# Altium project PCB_Project.PrjPcb (part 2 of 2)

## Sheet Deneigus_PI_Arduino.SchDoc
size Tabloid; Date: Date; Author: Author 1; Revision: 1; Size: 11x17; Sheet_Name: PI_Arduino
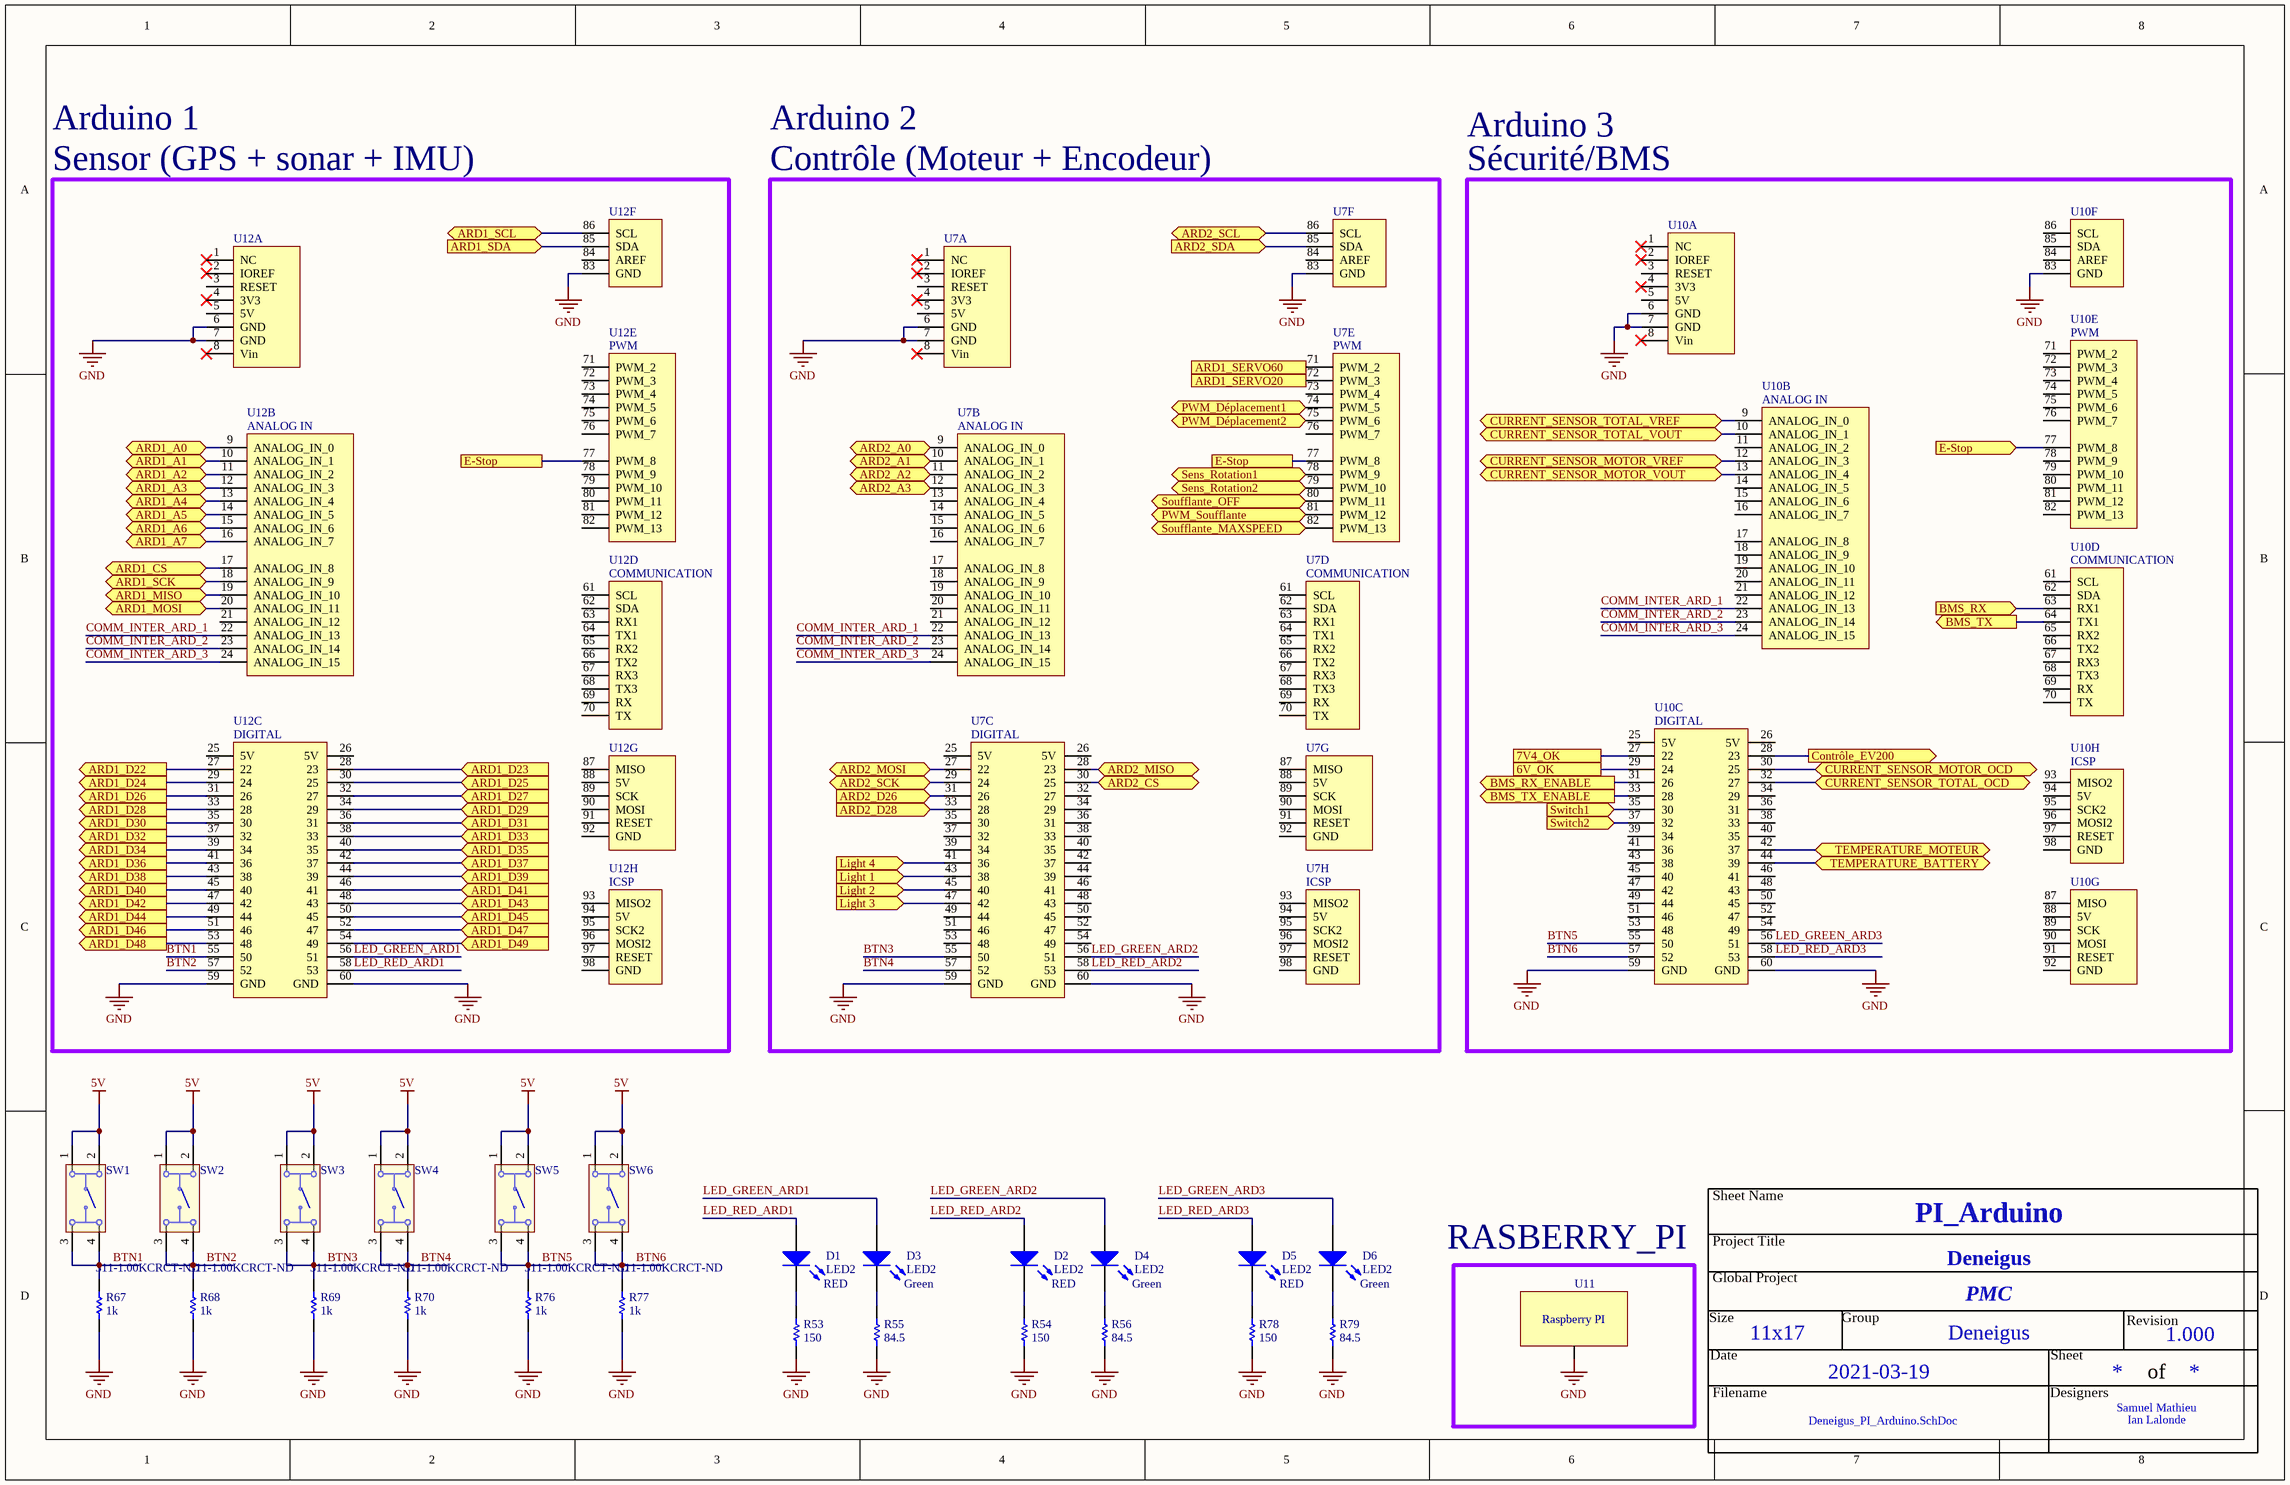
[diagram p6: Deneigus_PI_Arduino.SchDoc]

### Parts
D1  LED2  Color: RED  [DEL]
D2  LED2  Color: RED  [DEL]
D3  LED2  Color: Green  [DEL]
D4  LED2  Color: Green  [DEL]
D5  LED2  Color: RED  [DEL]
D6  LED2  Color: Green  [DEL]
R53  value 150  [RES_0805]  (hidden comment: Res1)
R54  value 150  [RES_0805]  (hidden comment: Res1)
R55  value 84.5  [RES_0805]  (hidden comment: Res1)
R56  value 84.5  [RES_0805]  (hidden comment: Res1)
R67  value 1k  Supplier Part Number 1: 311-1.00KCRCT-ND  [RES_0805]  (hidden comment: Res1)
R68  value 1k  Supplier Part Number 1: 311-1.00KCRCT-ND  [RES_0805]  (hidden comment: Res1)
R69  value 1k  Supplier Part Number 1: 311-1.00KCRCT-ND  [RES_0805]  (hidden comment: Res1)
R70  value 1k  Supplier Part Number 1: 311-1.00KCRCT-ND  [RES_0805]  (hidden comment: Res1)
R76  value 1k  Supplier Part Number 1: 311-1.00KCRCT-ND  [RES_0805]  (hidden comment: Res1)
R77  value 1k  Supplier Part Number 1: 311-1.00KCRCT-ND  [RES_0805]  (hidden comment: Res1)
R78  value 150  [RES_0805]  (hidden comment: Res1)
R79  value 84.5  [RES_0805]  (hidden comment: Res1)
SW1  430181038816  [430181038816]  (value not drawn)
SW2  430181038816  [430181038816]  (value not drawn)
SW3  430181038816  [430181038816]  (value not drawn)
SW4  430181038816  [430181038816]  (value not drawn)
SW5  430181038816  [430181038816]  (value not drawn)
SW6  430181038816  [430181038816]  (value not drawn)
U7  Arduino_Mega  [Arduino_Mega]  (value not drawn)  (parts A,B,C,D,E,F,G,H of 8)
U10  Arduino_Mega  [Arduino_Mega]  (value not drawn)  (parts A,B,C,D,E,F,G,H of 8)
U11  Raspberry PI 4  [Raspberry Pi 4]  (value not drawn)
U12  Arduino_Mega  [Arduino_Mega]  (value not drawn)  (parts A,B,C,D,E,F,G,H of 8)

### Blocks framed on the sheet
Sensor (GPS + sonar + IMU): U12
Contrôle (Moteur + Encodeur): U7
Sécurité/BMS: U10

### Ports
6V_OK, 7V4_OK, ARD1_A0 (bidir), ARD1_A1 (bidir), ARD1_A2 (bidir), ARD1_A3 (bidir), ARD1_A4 (bidir), ARD1_A5 (bidir), ARD1_A6 (bidir), ARD1_A7 (bidir), ARD1_CS (bidir), ARD1_D22 (out), ARD1_D23 (in), ARD1_D24 (out), ARD1_D25 (in), ARD1_D26 (out), ARD1_D27 (in), ARD1_D28 (out), ARD1_D29 (in), ARD1_D30 (out), ARD1_D31 (in), ARD1_D32 (out), ARD1_D33 (in), ARD1_D34 (out), ARD1_D35 (in), ARD1_D36 (out), ARD1_D37 (in), ARD1_D38 (out), ARD1_D39 (in), ARD1_D40 (out), ARD1_D41 (in), ARD1_D42 (out), ARD1_D43 (in), ARD1_D44 (out), ARD1_D45 (in), ARD1_D46 (out), ARD1_D47 (in), ARD1_D48 (out), ARD1_D49 (in), ARD1_MISO (bidir), ARD1_MOSI (bidir), ARD1_SCK (bidir), ARD1_SCL (bidir), ARD1_SDA (in), ARD1_SERVO20 (out), ARD1_SERVO60 (out), ARD2_A0 (bidir), ARD2_A1 (bidir), ARD2_A2 (bidir), ARD2_A3 (bidir), ARD2_CS (bidir), ARD2_D26 (in), ARD2_D28 (in), ARD2_MISO (bidir), ARD2_MOSI (bidir), ARD2_SCK (bidir), ARD2_SCL (bidir), ARD2_SDA (in), BMS_RX (in), BMS_RX_ENABLE (out), BMS_TX (out), BMS_TX_ENABLE (out), Contrôle_EV200 (out), CURRENT_SENSOR_MOTOR_OCD (bidir), CURRENT_SENSOR_MOTOR_VOUT (bidir), CURRENT_SENSOR_MOTOR_VREF (bidir), CURRENT_SENSOR_TOTAL_OCD (bidir), CURRENT_SENSOR_TOTAL_VOUT (bidir), CURRENT_SENSOR_TOTAL_VREF (bidir), E-Stop, E-Stop (in), Light 1 (in), Light 2 (in), Light 3 (in), Light 4 (in), PWM_Déplacement1 (bidir), PWM_Déplacement2 (bidir), PWM_Soufflante (bidir), Sens_Rotation1 (bidir), Sens_Rotation2 (bidir), Soufflante_MAXSPEED (bidir), Soufflante_OFF (bidir), Switch1 (in), Switch2 (in), TEMPERATURE_BATTERY (bidir), TEMPERATURE_MOTEUR (bidir)

### Nets
5V: SW1.1 SW1.2 SW2.1 SW2.2 SW3.1 SW3.2 SW4.1 SW4.2 SW5.1 SW5.2 SW6.1 SW6.2
GND: R53.2 R54.2 R55.2 R56.2 R67.2 R68.2 R69.2 R70.2 R76.2 R77.2 R78.2 R79.2 U7.6(GND) U7.7(GND) U7.59(GND) U7.60(GND) U7.83(GND) U10.6(GND) U10.7(GND) U10.59(GND) U10.60(GND) U10.83(GND) U11.0 U12.6(GND) U12.7(GND) U12.59(GND) U12.60(GND) U12.83(GND)
6V_OK: U10.29(24) ; port 6V_OK
7V4_OK: U10.27(22) ; port 7V4_OK
ARD1_A0: U12.9(ANALOG_IN_0) ; port ARD1_A0
ARD1_A1: U12.10(ANALOG_IN_1) ; port ARD1_A1
ARD1_A2: U12.11(ANALOG_IN_2) ; port ARD1_A2
ARD1_A3: U12.12(ANALOG_IN_3) ; port ARD1_A3
ARD1_A4: U12.13(ANALOG_IN_4) ; port ARD1_A4
ARD1_A5: U12.14(ANALOG_IN_5) ; port ARD1_A5
ARD1_A6: U12.15(ANALOG_IN_6) ; port ARD1_A6
ARD1_A7: U12.16(ANALOG_IN_7) ; port ARD1_A7
ARD1_CS: U12.17(ANALOG_IN_8) ; port ARD1_CS
ARD1_D22: U12.27(22) ; port ARD1_D22
ARD1_D23: U12.28(23) ; port ARD1_D23
ARD1_D24: U12.29(24) ; port ARD1_D24
ARD1_D25: U12.30(25) ; port ARD1_D25
ARD1_D26: U12.31(26) ; port ARD1_D26
ARD1_D27: U12.32(27) ; port ARD1_D27
ARD1_D28: U12.33(28) ; port ARD1_D28
ARD1_D29: U12.34(29) ; port ARD1_D29
ARD1_D30: U12.35(30) ; port ARD1_D30
ARD1_D31: U12.36(31) ; port ARD1_D31
ARD1_D32: U12.37(32) ; port ARD1_D32
ARD1_D33: U12.38(33) ; port ARD1_D33
ARD1_D34: U12.39(34) ; port ARD1_D34
ARD1_D35: U12.40(35) ; port ARD1_D35
ARD1_D36: U12.41(36) ; port ARD1_D36
ARD1_D37: U12.42(37) ; port ARD1_D37
ARD1_D38: U12.43(38) ; port ARD1_D38
ARD1_D39: U12.44(39) ; port ARD1_D39
ARD1_D40: U12.45(40) ; port ARD1_D40
ARD1_D41: U12.46(41) ; port ARD1_D41
ARD1_D42: U12.47(42) ; port ARD1_D42
ARD1_D43: U12.48(43) ; port ARD1_D43
ARD1_D44: U12.49(44) ; port ARD1_D44
ARD1_D45: U12.50(45) ; port ARD1_D45
ARD1_D46: U12.51(46) ; port ARD1_D46
ARD1_D47: U12.52(47) ; port ARD1_D47
ARD1_D48: U12.53(48) ; port ARD1_D48
ARD1_D49: U12.54(49) ; port ARD1_D49
ARD1_MISO: U12.19(ANALOG_IN_10) ; port ARD1_MISO
ARD1_MOSI: U12.20(ANALOG_IN_11) ; port ARD1_MOSI
ARD1_SCK: U12.18(ANALOG_IN_9) ; port ARD1_SCK
ARD1_SCL: U12.86(SCL) ; port ARD1_SCL
ARD1_SDA: U12.85(SDA) ; port ARD1_SDA
ARD1_SERVO20: U7.72(PWM_3) ; port ARD1_SERVO20
ARD1_SERVO60: U7.71(PWM_2) ; port ARD1_SERVO60
ARD2_A0: U7.9(ANALOG_IN_0) ; port ARD2_A0
ARD2_A1: U7.10(ANALOG_IN_1) ; port ARD2_A1
ARD2_A2: U7.11(ANALOG_IN_2) ; port ARD2_A2
ARD2_A3: U7.12(ANALOG_IN_3) ; port ARD2_A3
ARD2_CS: U7.30(25) ; port ARD2_CS
ARD2_D26: U7.31(26) ; port ARD2_D26
ARD2_D28: U7.33(28) ; port ARD2_D28
ARD2_MISO: U7.28(23) ; port ARD2_MISO
ARD2_MOSI: U7.27(22) ; port ARD2_MOSI
ARD2_SCK: U7.29(24) ; port ARD2_SCK
ARD2_SCL: U7.86(SCL) ; port ARD2_SCL
ARD2_SDA: U7.85(SDA) ; port ARD2_SDA
BMS_RX: U10.63(RX1) ; port BMS_RX
BMS_RX_ENABLE: U10.31(26) ; port BMS_RX_ENABLE
BMS_TX: U10.64(TX1) ; port BMS_TX
BMS_TX_ENABLE: U10.33(28) ; port BMS_TX_ENABLE
BTN1: R67.1 SW1.3 SW1.4 U12.55(50)
BTN2: R68.1 SW2.3 SW2.4 U12.57(52)
BTN3: R69.1 SW3.3 SW3.4 U7.55(50)
BTN4: R70.1 SW4.3 SW4.4 U7.57(52)
BTN5: R76.1 SW5.3 SW5.4 U10.55(50)
BTN6: R77.1 SW6.3 SW6.4 U10.57(52)
COMM_INTER_ARD_1: U7.22(ANALOG_IN_13) U10.22(ANALOG_IN_13) U12.22(ANALOG_IN_13)
COMM_INTER_ARD_2: U7.23(ANALOG_IN_14) U10.23(ANALOG_IN_14) U12.23(ANALOG_IN_14)
COMM_INTER_ARD_3: U7.24(ANALOG_IN_15) U10.24(ANALOG_IN_15) U12.24(ANALOG_IN_15)
Contrôle_EV200: U10.28(23) ; port Contrôle_EV200
CURRENT_SENSOR_MOTOR_OCD: U10.30(25) ; port CURRENT_SENSOR_MOTOR_OCD
CURRENT_SENSOR_MOTOR_VOUT: U10.13(ANALOG_IN_4) ; port CURRENT_SENSOR_MOTOR_VOUT
CURRENT_SENSOR_MOTOR_VREF: U10.12(ANALOG_IN_3) ; port CURRENT_SENSOR_MOTOR_VREF
CURRENT_SENSOR_TOTAL_OCD: U10.32(27) ; port CURRENT_SENSOR_TOTAL_OCD
CURRENT_SENSOR_TOTAL_VOUT: U10.10(ANALOG_IN_1) ; port CURRENT_SENSOR_TOTAL_VOUT
CURRENT_SENSOR_TOTAL_VREF: U10.9(ANALOG_IN_0) ; port CURRENT_SENSOR_TOTAL_VREF
E-Stop: U7.77(PWM_8) U10.77(PWM_8) U12.77(PWM_8) ; port E-Stop
LED_GREEN_ARD1: D3.1(A) U12.56(51)
LED_GREEN_ARD2: D4.1(A) U7.56(51)
LED_GREEN_ARD3: D6.1(A) U10.56(51)
LED_RED_ARD1: D1.1(A) U12.58(53)
LED_RED_ARD2: D2.1(A) U7.58(53)
LED_RED_ARD3: D5.1(A) U10.58(53)
Light 1: U7.43(38) ; port Light 1
Light 2: U7.45(40) ; port Light 2
Light 3: U7.47(42) ; port Light 3
Light 4: U7.41(36) ; port Light 4
PWM_Déplacement1: U7.74(PWM_5) ; port PWM_Déplacement1
PWM_Déplacement2: U7.75(PWM_6) ; port PWM_Déplacement2
PWM_Soufflante: U7.81(PWM_12) ; port PWM_Soufflante
Sens_Rotation1: U7.78(PWM_9) ; port Sens_Rotation1
Sens_Rotation2: U7.79(PWM_10) ; port Sens_Rotation2
Soufflante_MAXSPEED: U7.82(PWM_13) ; port Soufflante_MAXSPEED
Soufflante_OFF: U7.80(PWM_11) ; port Soufflante_OFF
Switch1: U10.35(30) ; port Switch1
Switch2: U10.37(32) ; port Switch2
TEMPERATURE_BATTERY: U10.44(39) ; port TEMPERATURE_BATTERY
TEMPERATURE_MOTEUR: U10.42(37) ; port TEMPERATURE_MOTEUR
NetD1_2: D1.2(K) R53.1
NetD2_2: D2.2(K) R54.1
NetD3_2: D3.2(K) R55.1
NetD4_2: D4.2(K) R56.1
NetD5_2: D5.2(K) R78.1
NetD6_2: D6.2(K) R79.1

Not connected (* = marked no-connect by the designer): U7 1(NC)* 2(IOREF)* 3(RESET) 4(3V3)* 5(5V) 8(Vin)* 13(ANALOG_IN_4) 14(ANALOG_IN_5) 15(ANALOG_IN_6) 16(ANALOG_IN_7) 17(ANALOG_IN_8) 18(ANALOG_IN_9) 19(ANALOG_IN_10) 20(ANALOG_IN_11) 21(ANALOG_IN_12) 25(5V) 26(5V) 32(27) 34(29) 35(30) 36(31) 37(32) 38(33) 39(34) 40(35) 42(37) 44(39) 46(41) 48(43) 49(44) 50(45) 51(46) 52(47) 53(48) 54(49) 61(SCL) 62(SDA) 63(RX1) 64(TX1) 65(RX2) 66(TX2) 67(RX3) 68(TX3) 69(RX) 70(TX) 73(PWM_4) 76(PWM_7) 84(AREF) 87(MISO) 88(5V) 89(SCK) 90(MOSI) 91(RESET) 92(GND) 93(MISO2) 94(5V) 95(SCK2) 96(MOSI2) 97(RESET) 98(GND); U10 1(NC)* 2(IOREF)* 3(RESET) 4(3V3)* 5(5V) 8(Vin)* 11(ANALOG_IN_2) 14(ANALOG_IN_5) 15(ANALOG_IN_6) 16(ANALOG_IN_7) 17(ANALOG_IN_8) 18(ANALOG_IN_9) 19(ANALOG_IN_10) 20(ANALOG_IN_11) 21(ANALOG_IN_12) 25(5V) 26(5V) 34(29) 36(31) 38(33) 39(34) 40(35) 41(36) 43(38) 45(40) 46(41) 47(42) 48(43) 49(44) 50(45) 51(46) 52(47) 53(48) 54(49) 61(SCL) 62(SDA) 65(RX2) 66(TX2) 67(RX3) 68(TX3) 69(RX) 70(TX) 71(PWM_2) 72(PWM_3) 73(PWM_4) 74(PWM_5) 75(PWM_6) 76(PWM_7) 78(PWM_9) 79(PWM_10) 80(PWM_11) 81(PWM_12) 82(PWM_13) 84(AREF) 85(SDA) 86(SCL) 87(MISO) 88(5V) 89(SCK) 90(MOSI) 91(RESET) 92(GND) 93(MISO2) 94(5V) 95(SCK2) 96(MOSI2) 97(RESET) 98(GND); U12 1(NC)* 2(IOREF)* 3(RESET) 4(3V3)* 5(5V) 8(Vin)* 21(ANALOG_IN_12) 25(5V) 26(5V) 61(SCL) 62(SDA) 63(RX1) 64(TX1) 65(RX2) 66(TX2) 67(RX3) 68(TX3) 69(RX) 70(TX) 71(PWM_2) 72(PWM_3) 73(PWM_4) 74(PWM_5) 75(PWM_6) 76(PWM_7) 78(PWM_9) 79(PWM_10) 80(PWM_11) 81(PWM_12) 82(PWM_13) 84(AREF) 87(MISO) 88(5V) 89(SCK) 90(MOSI) 91(RESET) 92(GND) 93(MISO2) 94(5V) 95(SCK2) 96(MOSI2) 97(RESET) 98(GND)

### Notes on the sheet
- Arduino 1
- Arduino 2
- Arduino 3
- RASBERRY_PI
- Sheet Name
- Project Title
- Global Project
- Revision
- Size
- Date
- Group
- Sheet
- of
- Filename
- Designers
- (in symbol Arduino_Mega, part B) ANALOG IN
- (in symbol Arduino_Mega, part C) DIGITAL
- (in symbol Arduino_Mega, part D) COMMUNICATION
- (in symbol Arduino_Mega, part E) PWM
- (in symbol Arduino_Mega, part H) ICSP
- (in symbol Raspberry PI 4) Raspberry PI

### Library data of the parts
D1-D6 = LED2: Typical RED, GREEN, YELLOW, AMBER GaAs LED; Published: 8-Jun-2000; LatestRevisionDate: 17-Jul-2002; LatestRevisionNote: Re-released for DXP Platform.; PackageVersion: Feb-2002; PackageReference: 3.2X1.6X1.1; Publisher: Altium Limited; PackageDescription: SM LED; 2 Flat Leads
  D1: Supplier 1: Digi-Key; Supplier Part Number 1: 754-1796-1-ND
  D2 D5: Supplier 1: Digikey; Supplier Part Number 1: 754-1796-1-ND
  D3 D4 D6: Supplier 1: Digi-Key; Supplier Part Number 1: 754-1440-1-ND
R53-R56 R67-R70 R76-R79 = Res1: Resistor; Published: 8-Jun-2000; LatestRevisionDate: 17-Jul-2002; LatestRevisionNote: Re-released for DXP Platform.; PackageReference: AXIAL-0.3; Publisher: Altium Limited; PackageDescription: Axial Device, Thru-Hole; 2 Leads; 0.3 in Pin Spacing
  R53 R54 R78: Supplier 1: digikey; Supplier Part Number 1: RNCP0805FTD150RCT-ND
  R55 R56 R79: Supplier 1: digikey; Supplier Part Number 1: 2019-RK73H2ATTD84R5FCT-ND
  R67-R70 R76 R77: Supplier 1: Digi-Key
SW1-SW6 = CMP-1454-00001-1: WS-TASV SMD Tact Switch 4.5X4.5 mm; Manufacturer: Wuerth Elektronik; NoPins: 04; PartNumber: 430181038816; ComponentLink1Description: Manufacturer URL; ComponentLink2URL: http://katalog.we-online.de/em/datasheet/430181038816.pdf; ComponentLink1URL: http://www.we-online.com; PackageReference: 430181038816; ComponentLink2Description: Datasheet

## Sheet Deneigus_BMS.SchDoc
size Tabloid; Date: Date; Author: Author 1; Revision: 1; Size: 11x17; Sheet_Name: BMS
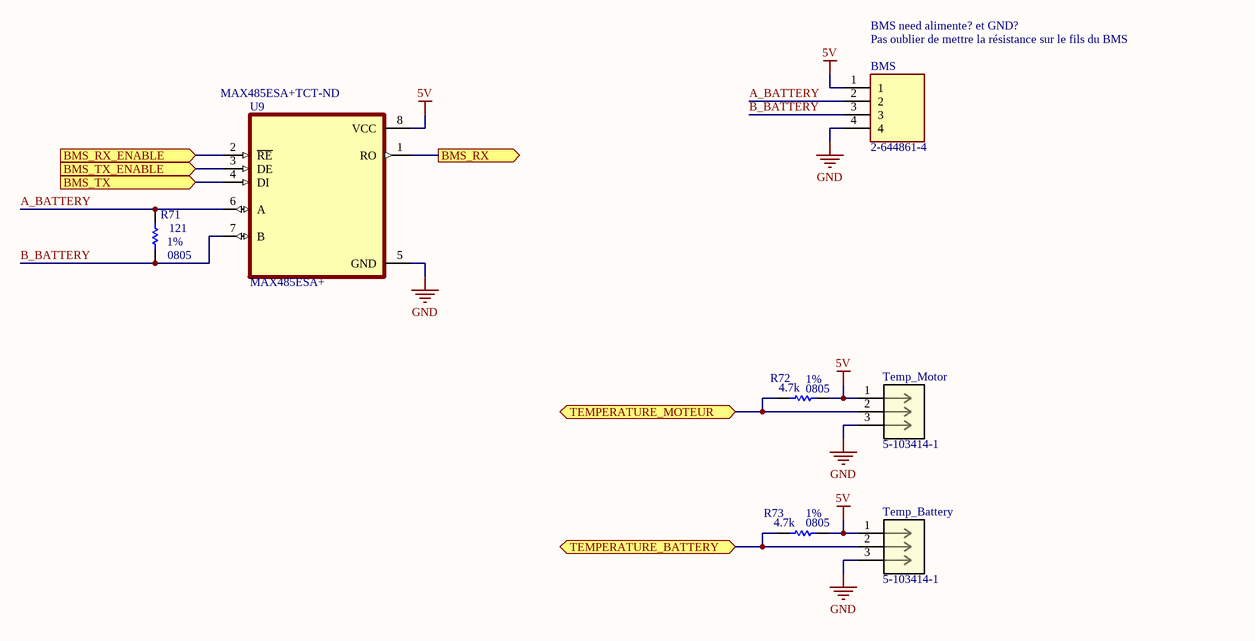
[diagram p7: Deneigus_BMS.SchDoc]

### Parts
BMS  2-644861-4  [TE_2-644861-4]
R71  value 121  Package: 0805  Precision: 1%  [RES_0805]  (hidden comment: RES - 0805)
R72  value 4.7k  Package: 0805  Precision: 1%  [RES_0805]  (hidden comment: RES - 0805)
R73  value 4.7k  Package: 0805  Precision: 1%  [RES_0805]  (hidden comment: RES - 0805)
Temp_Battery  5-103414-1  [CONN_5-103414-1_TYCO]
Temp_Motor  5-103414-1  [CONN_5-103414-1_TYCO]
U9  MAX485ESA+  Supplier Part Number 1: MAX485ESA+TCT-ND  [SOIC127P600X175-8N]

### Ports
BMS_RX (out), BMS_RX_ENABLE (in), BMS_TX (in), BMS_TX_ENABLE (in), TEMPERATURE_BATTERY (bidir), TEMPERATURE_MOTEUR (bidir)

### Nets
5V: BMS.1 R72.2 R73.2 Temp_Battery.1 Temp_Motor.1 U9.8(VCC)
GND: BMS.4 Temp_Battery.3 Temp_Motor.3 U9.5(GND)
A_BATTERY: BMS.2 R71.2 U9.6(A)
B_BATTERY: BMS.3 R71.1 U9.7(B)
BMS_RX: U9.1(RO) ; port BMS_RX
BMS_RX_ENABLE: U9.2(~{RE}) ; port BMS_RX_ENABLE
BMS_TX: U9.4(DI) ; port BMS_TX
BMS_TX_ENABLE: U9.3(DE) ; port BMS_TX_ENABLE
TEMPERATURE_BATTERY: R73.1 Temp_Battery.2 ; port TEMPERATURE_BATTERY
TEMPERATURE_MOTEUR: R72.1 Temp_Motor.2 ; port TEMPERATURE_MOTEUR

### Notes on the sheet
- BMS need alimente? et GND?
- (near BMS) Pas oublier de mettre la résistance sur le fils du BMS
- Sheet Name
- Project Title
- Global Project
- Revision
- Size
- Date
- Group
- Sheet
- of
- Filename
- Designers

### Library data of the parts
BMS = 2-644861-4: Connector Header Through Hole 4 position 0.100 (2.54mm); MF: TE Connectivity; Availability: Good; Value: *; Check_prices: https://www.snapeda.com/parts/2-644861-4/TE%20Connectivity%20AMP%20Connectors/view-part/2876279/?ref=eda; Package: None; Price: None; MP: 2-644861-4; SnapEDA_Link: https://www.snapeda.com/parts/2-644861-4/TE%20Connectivity%20AMP%20Connectors/view-part/2876279/?ref=snap; Purchase-URL: https://pricing.snapeda.com/search/part/2-644861-4/?ref=eda
Temp_Battery Temp_Motor = 5-103414-1: No Description Available; Vendor: TE Connectivity; Built_By: EMA_UL_Team; SourceLibrary: Tyco_2012-1-03; Manufacturer_Part_Number: 5-103414-1; Copyright: Copyright (C) 2016 Accelerated Designs. All rights reserved; RefDes: RefDes; Type: DEV; Supplier 1: Digikey; Supplier Part Number 1: A32977-ND
U9 = MAX485ESA+: 1/1 Transceiver Half RS422, RS485 8-SOIC; MF: Maxim Integrated; Availability: Unavailable; SnapEDA_Link: https://www.snapeda.com/parts/MAX485ESA%2B/Maxim%20Integrated/view-part/553653/?ref=snap; MP: MAX485ESA+; Value: *; Price: None; Package: SOIC-8 Maxim; Supplier 1: Digi-Key
R71-R73 = RES - 0805: Current: *; CreatedBy: Jonathan Bouchard

## Sheet Deneigus_Servo.SchDoc
size Tabloid; Sheet_Name: Alimentation Servo-moteur; Size: 11x17
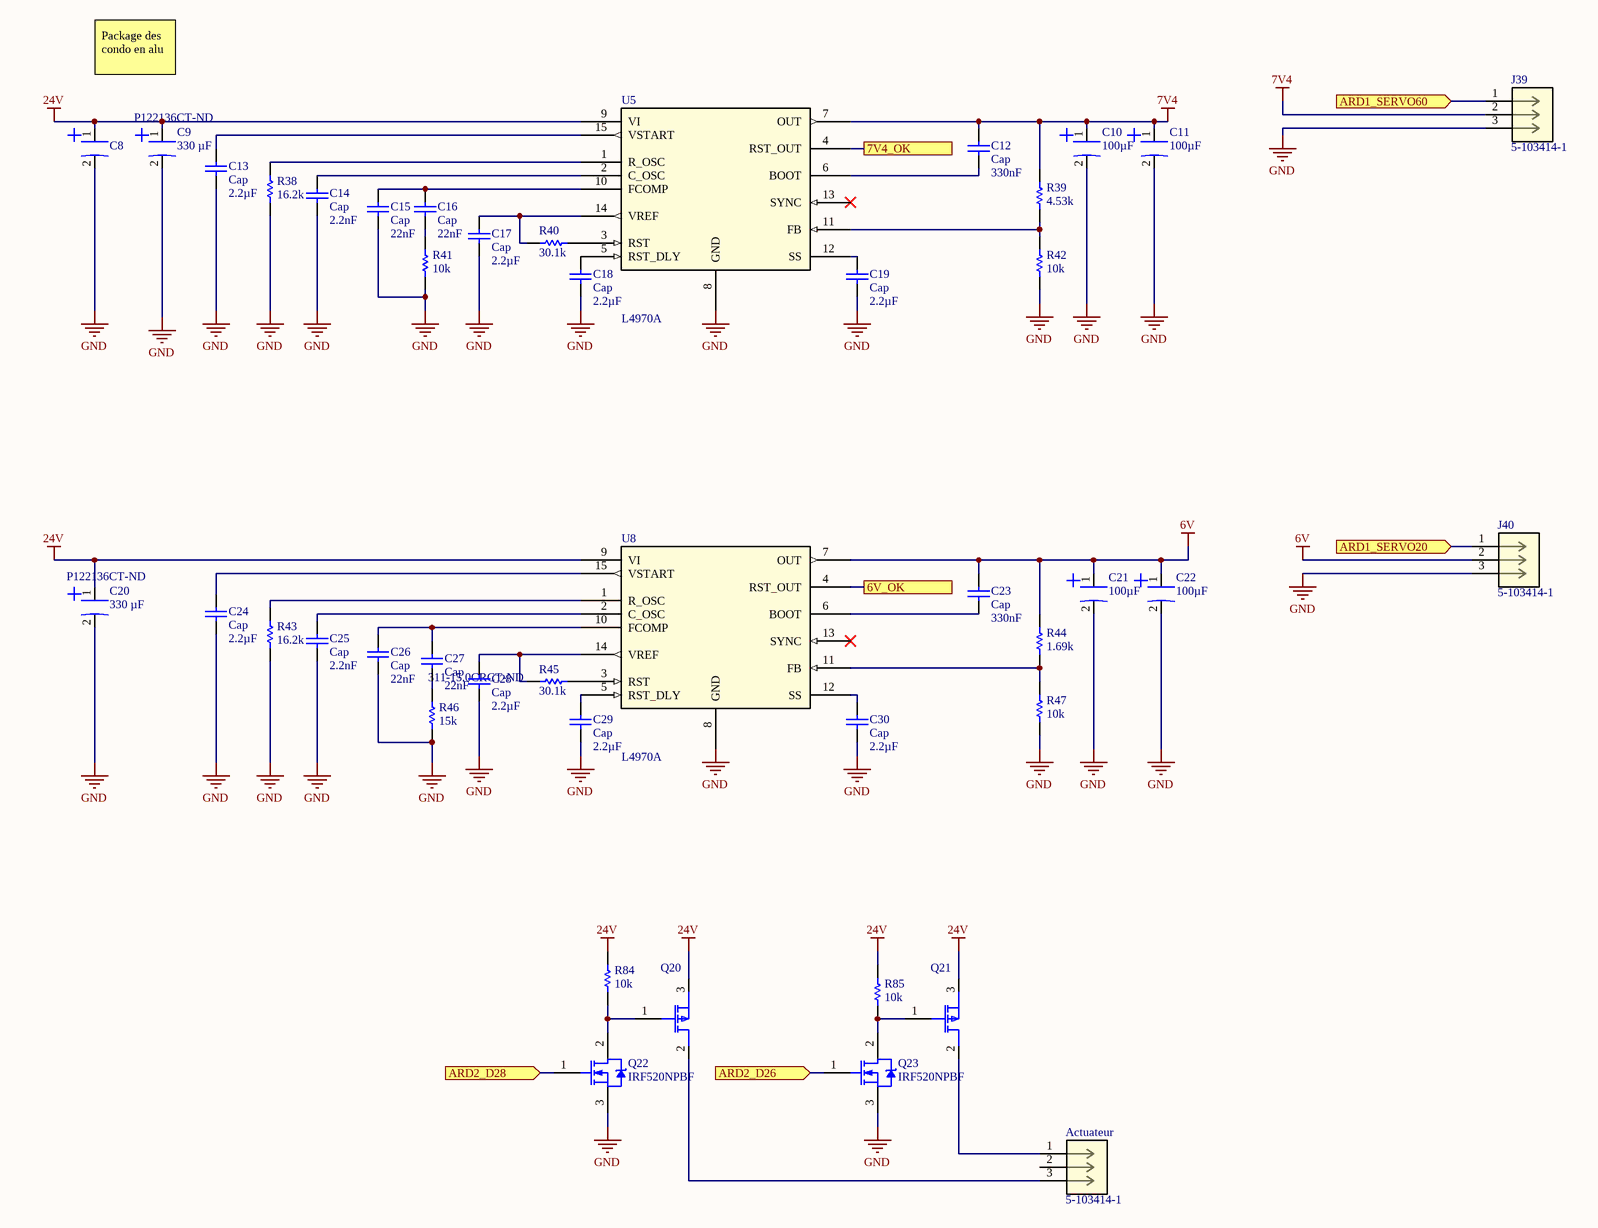
[diagram p8: Deneigus_Servo.SchDoc]

### Parts
Actuateur  5-103414-1  [CONN_5-103414-1_TYCO]
C8  CAP ALUM 3300UF 20% 50V SNAP  [3300 uF 50V Cap]  (value not drawn)
C9  value 330 µF  Supplier Part Number 1: P122136CT-ND  [330uF (10.3x10.3mm)]  (hidden comment: CAP ALUM POLY 47UF 20% 16V SMD)
C10  value 100µF  [47uF]  (hidden comment: CAP ALUM POLY 47UF 20% 16V SMD)
C11  value 100µF  [47uF]  (hidden comment: CAP ALUM POLY 47UF 20% 16V SMD)
C12  Cap  value 330nF  [CAP_0805]
C13  Cap  value 2.2µF  [CAP_0805]
C14  Cap  value 2.2nF  [CAP_0805]
C15  Cap  value 22nF  [RAD-0.3]
C16  Cap  value 22nF  [RAD-0.3]
C17  Cap  value 2.2µF  [CAP_0805]
C18  Cap  value 2.2µF  [CAP_0805]
C19  Cap  value 2.2µF  [CAP_0805]
C20  value 330 µF  Supplier Part Number 1: P122136CT-ND  [330uF (10.3x10.3mm)]  (hidden comment: CAP ALUM POLY 47UF 20% 16V SMD)
C21  value 100µF  [47uF]  (hidden comment: CAP ALUM POLY 47UF 20% 16V SMD)
C22  value 100µF  [47uF]  (hidden comment: CAP ALUM POLY 47UF 20% 16V SMD)
C23  Cap  value 330nF  [CAP_0805]
C24  Cap  value 2.2µF  [CAP_0805]
C25  Cap  value 2.2nF  [CAP_0805]
C26  Cap  value 22nF  [RAD-0.3]
C27  Cap  value 22nF  [RAD-0.3]
C28  Cap  value 2.2µF  [CAP_0805]
C29  Cap  value 2.2µF  [CAP_0805]
C30  Cap  value 2.2µF  [CAP_0805]
J39  5-103414-1  [CONN_5-103414-1_TYCO]
J40  5-103414-1  [CONN_5-103414-1_TYCO]
Q20  MOSFET P-CH 55V 12A TO220AB  [IRF9Z24NPBF]  (value not drawn)
Q21  MOSFET P-CH 55V 12A TO220AB  [IRF9Z24NPBF]  (value not drawn)
Q22  IRF520NPBF  [INTR-TO-220AB-3]
Q23  IRF520NPBF  [INTR-TO-220AB-3]
R38  value 16.2k  [RES_0805]  (hidden comment: Res1)
R39  value 4.53k  [RES_0805]  (hidden comment: Res1)
R40  value 30.1k  [RES_0805]  (hidden comment: Res1)
R41  value 10k  [RES_0805]  (hidden comment: Res1)
R42  value 10k  [RES_0805]  (hidden comment: Res1)
R43  value 16.2k  [RES_0805]  (hidden comment: Res1)
R44  value 1.69k  [RES_0805]  (hidden comment: Res1)
R45  value 30.1k  [RES_0805]  (hidden comment: Res1)
R46  value 15k  Supplier Part Number 1: 311-15.0CRCT-ND  [RES_0805]  (hidden comment: Res1)
R47  value 10k  [RES_0805]  (hidden comment: Res1)
R84  value 10k  [RES_0805]  (hidden comment: Res1)
R85  value 10k  [RES_0805]  (hidden comment: Res1)
U5  L4970A  [Multiwatt15_V_STM]
U8  L4970A  [Multiwatt15_V_STM]

### Ports
6V_OK, 7V4_OK, ARD1_SERVO20 (in), ARD1_SERVO60 (in), ARD2_D26 (in), ARD2_D28 (in)

### Nets
6V: C21.1 C22.1 C23.2 J40.2 R44.1 U8.7(OUT)
7V4: C10.1 C11.1 C12.2 J39.2 R39.1 U5.7(OUT)
24V: C8.1 C9.1 C20.1 Q20.3(Source) Q21.3(Source) R84.1 R85.1 U5.9(VI) U8.9(VI)
GND: C8.2 C9.2 C10.2 C11.2 C13.1 C14.1 C15.1 C17.1 C18.1 C19.1 C20.2 C21.2 C22.2 C24.1 C25.1 C26.1 C28.1 C29.1 C30.1 J39.3 J40.3 Q22.3(S) Q23.3(S) R38.2 R41.2 R42.2 R43.2 R46.2 R47.2 U5.8(GND) U8.8(GND)
6V_OK: U8.4(RST_OUT) ; port 6V_OK
7V4_OK: U5.4(RST_OUT) ; port 7V4_OK
ARD1_SERVO20: J40.1 ; port ARD1_SERVO20
ARD1_SERVO60: J39.1 ; port ARD1_SERVO60
ARD2_D26: Q23.1(G) ; port ARD2_D26
ARD2_D28: Q22.1(G) ; port ARD2_D28
NetActuateur_1: Actuateur.1 Q21.2(Drain)
NetActuateur_3: Actuateur.3 Q20.2(Drain)
NetC12_1: C12.1 U5.6(BOOT)
NetC13_2: C13.2 U5.15(VSTART)
NetC14_2: C14.2 U5.2(C_OSC)
NetC15_2: C15.2 C16.2 U5.10(FCOMP)
NetC16_1: C16.1 R41.1
NetC17_2: C17.2 R40.1 U5.14(VREF)
NetC18_2: C18.2 U5.5(RST_DLY)
NetC19_2: C19.2 U5.12(SS)
NetC23_1: C23.1 U8.6(BOOT)
NetC24_2: C24.2 U8.15(VSTART)
NetC25_2: C25.2 U8.2(C_OSC)
NetC26_2: C26.2 C27.2 U8.10(FCOMP)
NetC27_1: C27.1 R46.1
NetC28_2: C28.2 R45.1 U8.14(VREF)
NetC29_2: C29.2 U8.5(RST_DLY)
NetC30_2: C30.2 U8.12(SS)
NetQ20_1: Q20.1(Gate) Q22.2(D) R84.2
NetQ21_1: Q21.1(Gate) Q23.2(D) R85.2
NetR38_1: R38.1 U5.1(R_OSC)
NetR39_2: R39.2 R42.1 U5.11(FB)
NetR40_2: R40.2 U5.3(RST)
NetR43_1: R43.1 U8.1(R_OSC)
NetR44_2: R44.2 R47.1 U8.11(FB)
NetR45_2: R45.2 U8.3(RST)

Not connected (* = marked no-connect by the designer): Actuateur 2; U5 13(SYNC)*; U8 13(SYNC)*

### Notes on the sheet
- Package des condo en alu
- Sheet Name
- Project Title
- Global Project
- Size
- Group
- Revision
- Date
- Sheet
- of
- Filename
- Designers

### Library data of the parts
Actuateur J39 J40 = 5-103414-1: as Temp_Battery on sheet Deneigus_BMS; Manufacturer_Part_Number: 5-103414-1; Copyright: Copyright (C) 2016 Accelerated Designs. All rights reserved; RefDes: RefDes; Type: DEV; Supplier 1: Digikey; Supplier Part Number 1: A32977-ND
C8 = 3300 µF 50V: value: 3300µF; Supplier 1: Digi-Key; Supplier Part Number 1: 338-2545-ND; Voltage: 50V; tolerance: 20%
C9 C20 = 47µF SMD: Mfg Part Number: 875105344006; Mfg: Würth Elektronik; HelpURL: https://www.we-online.de/katalog/datasheet/875105344006.pdf; Supplier 1: Digi-Key
C10 C11 C21 C22 = 47µF SMD: Mfg Part Number: 875105344010; Mfg: Würth Elektronik; Supplier 1: Digikey; Supplier Part Number 1: 732-6425-2-ND; HelpURL: https://www.we-online.de/katalog/datasheet/875105344010.pdf
C12-C19 C23-C30 = Cap: Capacitor; Published: 8-Jun-2000; LatestRevisionDate: 17-Jul-2002; LatestRevisionNote: Re-released for DXP Platform.; Publisher: Altium Limited; PackageDescription: Radial Cap, Thru-Hole; 2 Leads; 0.3 in Pin Spacing
  C12 C23: PackageReference: RAD-0.3; Supplier 1: Digi-Key; Supplier Part Number 1: 1276-1123-1-ND
  C13 C17-C19 C24 C28-C30: PackageReference: RAD-0.3; Supplier 1: Digi-Key; Supplier Part Number 1: 445-5968-1-ND
  C14 C25: PackageReference: 0805; Supplier 1: Digi-Key; Supplier Part Number 1: 1276-1171-1-ND
  C15 C16 C26 C27: PackageReference: RAD-0.3; Supplier 1: Digikey; Supplier Part Number 1: 1276-2488-1-ND
Q20 Q21 = IRF9Z24NPBF: Supplier 1: Digikey; Supplier Part Number 1: IRF9Z24NPBF-ND
Q22 Q23 = CMP-013-00017-4: HEXFET(R) Power MOSFET, 100 V, 9.7 A, 0.2 Ohm, -55 to 175 degC, 3-Pin FM (TO-220AB), RoHS, Tube; Manufacturer: International Rectifier; Power: 48W; Elements: 1; Typical Rise Time: 23ns; Nominal Dual Supply Voltage: 100V; Rds On Max: 200mohm; Input Capacitance: 330pF; Nominal Vgs: 4V; Package Reference: TO-220AB; Max Operating Temperature: 175°C; Datasheet Version: Nov-03; Datasheet URL: http://www.infineon.com/dgdl/irf520npbf.pdf?fileId=5546d462533600a4015355e340711985; Package Quantity: 50; Package Description: 3-Pin Flange Mount, Body 4.445 x 10.415 mm, Pitch 2.54 mm; Pins: 3; Packaging: Rail/Tube; RoHS Compliant: True; Min Operating Temperature: -55°C; Case/Package: TO-220-3; Mounting Technology: TH
R38-R47 R84 R85 = Res1: Resistor; Published: 8-Jun-2000; LatestRevisionDate: 17-Jul-2002; LatestRevisionNote: Re-released for DXP Platform.; PackageReference: AXIAL-0.3; Publisher: Altium Limited; PackageDescription: Axial Device, Thru-Hole; 2 Leads; 0.3 in Pin Spacing
  R38 R43: Supplier 1: digikey; Supplier Part Number 1: 2019-RK73H2ATTD1622FCT-ND
  R39: Supplier 1: digikey; Supplier Part Number 1: RNCP0805FTD4K53CT-ND
  R40 R45: Supplier 1: digikey; Supplier Part Number 1: RMCF0805FT30K1CT-ND
  R41 R42 R47 R84 R85: Supplier 1: digikey; Supplier Part Number 1: RNCP0805FTD10K0CT-ND
  R44: Supplier 1: digikey; Supplier Part Number 1: RMCF0805FT1K69CT-ND
  R46: Supplier 1: Digi-Key
U5 U8 = L4970A: No Description Available; SourceLibrary: Updates_to_database_2020-11-02; Built_By: EMA_UL_Team; Vendor: STMicroelectronics; Manufacturer_Part_Number: L4970A; Copyright: Copyright (C) 2018 Accelerated Designs. All rights reserved; RefDes: RefDes; Type: DEV

## Nets that join several sheets
5V: Deneigus_POWER (F1.1 F3.2), Deneigus_Controle_Deplacement (16 pins), Deneigus_Sensors (39 pins), Deneigus_PI_Arduino (12 pins), Deneigus_BMS (6 pins)
24V: Deneigus_POWER (F2.1), Deneigus_Sensors (9 pins), Deneigus_Servo (9 pins)
GND: Deneigus_POWER (9 pins), Deneigus_Controle_Soufflante (C35.2 Q14.2 Q16.2 Q17.2), Deneigus_Controle_Deplacement (24 pins), Deneigus_Sensors (43 pins), Deneigus_PI_Arduino (28 pins), Deneigus_BMS (BMS.4 Temp_Battery.3 Temp_Motor.3 U9.5), Deneigus_Servo (31 pins)
6V_OK: Deneigus_PI_Arduino (U10.29), Deneigus_Servo (U8.4)
7V4_OK: Deneigus_PI_Arduino (U10.27), Deneigus_Servo (U5.4)
ARD1_A0: Deneigus_Sensors (Q31.1), Deneigus_PI_Arduino (U12.9)
ARD1_A1: Deneigus_Sensors (Q35.1), Deneigus_PI_Arduino (U12.10)
ARD1_A2: Deneigus_Sensors (Q32.1), Deneigus_PI_Arduino (U12.11)
ARD1_A3: Deneigus_Sensors (Q34.1), Deneigus_PI_Arduino (U12.12)
ARD1_A4: Deneigus_Sensors (J23.2), Deneigus_PI_Arduino (U12.13)
ARD1_A5: Deneigus_Sensors (J23.3), Deneigus_PI_Arduino (U12.14)
ARD1_A6: Deneigus_Sensors (J25.2), Deneigus_PI_Arduino (U12.15)
ARD1_A7: Deneigus_Sensors (J25.3), Deneigus_PI_Arduino (U12.16)
ARD1_CS: Deneigus_Sensors (J41.2), Deneigus_PI_Arduino (U12.17)
ARD1_D22: Deneigus_Sensors (FLL.2), Deneigus_PI_Arduino (U12.27)
ARD1_D23: Deneigus_Sensors (FLL.3), Deneigus_PI_Arduino (U12.28)
ARD1_D24: Deneigus_Sensors (BLL.2), Deneigus_PI_Arduino (U12.29)
ARD1_D25: Deneigus_Sensors (BLL.3), Deneigus_PI_Arduino (U12.30)
ARD1_D26: Deneigus_Sensors (LF.2), Deneigus_PI_Arduino (U12.31)
ARD1_D27: Deneigus_Sensors (LF.3), Deneigus_PI_Arduino (U12.32)
ARD1_D28: Deneigus_Sensors (FL.2), Deneigus_PI_Arduino (U12.33)
ARD1_D29: Deneigus_Sensors (FL.3), Deneigus_PI_Arduino (U12.34)
ARD1_D30: Deneigus_Sensors (BL.2), Deneigus_PI_Arduino (U12.35)
ARD1_D31: Deneigus_Sensors (BL.3), Deneigus_PI_Arduino (U12.36)
ARD1_D32: Deneigus_Sensors (LB.2), Deneigus_PI_Arduino (U12.37)
ARD1_D33: Deneigus_Sensors (LB.3), Deneigus_PI_Arduino (U12.38)
ARD1_D34: Deneigus_Sensors (FM.2), Deneigus_PI_Arduino (U12.39)
ARD1_D35: Deneigus_Sensors (FM.3), Deneigus_PI_Arduino (U12.40)
ARD1_D36: Deneigus_Sensors (BM.2), Deneigus_PI_Arduino (U12.41)
ARD1_D37: Deneigus_Sensors (BM.3), Deneigus_PI_Arduino (U12.42)
ARD1_D38: Deneigus_Sensors (BRR.2), Deneigus_PI_Arduino (U12.43)
ARD1_D39: Deneigus_Sensors (BRR.3), Deneigus_PI_Arduino (U12.44)
ARD1_D40: Deneigus_Sensors (FR.2), Deneigus_PI_Arduino (U12.45)
ARD1_D41: Deneigus_Sensors (FR.3), Deneigus_PI_Arduino (U12.46)
ARD1_D42: Deneigus_Sensors (BR.2), Deneigus_PI_Arduino (U12.47)
ARD1_D43: Deneigus_Sensors (BR.3), Deneigus_PI_Arduino (U12.48)
ARD1_D44: Deneigus_Sensors (RB.2), Deneigus_PI_Arduino (U12.49)
ARD1_D45: Deneigus_Sensors (RB.3), Deneigus_PI_Arduino (U12.50)
ARD1_D46: Deneigus_Sensors (RF.2), Deneigus_PI_Arduino (U12.51)
ARD1_D47: Deneigus_Sensors (RF.3), Deneigus_PI_Arduino (U12.52)
ARD1_D48: Deneigus_Sensors (FRR.2), Deneigus_PI_Arduino (U12.53)
ARD1_D49: Deneigus_Sensors (FRR.3), Deneigus_PI_Arduino (U12.54)
ARD1_MISO: Deneigus_Sensors (J41.4), Deneigus_PI_Arduino (U12.19)
ARD1_MOSI: Deneigus_Sensors (J41.5), Deneigus_PI_Arduino (U12.20)
ARD1_SCK: Deneigus_Sensors (J41.3), Deneigus_PI_Arduino (U12.18)
ARD1_SCL: Deneigus_Sensors (IMU.3 J7.17 J36.2), Deneigus_PI_Arduino (U12.86)
ARD1_SDA: Deneigus_Sensors (IMU.4 J7.16 J36.3), Deneigus_PI_Arduino (U12.85)
ARD1_SERVO20: Deneigus_PI_Arduino (U7.72), Deneigus_Servo (J40.1)
ARD1_SERVO60: Deneigus_PI_Arduino (U7.71), Deneigus_Servo (J39.1)
ARD2_A0: Deneigus_Sensors (J28.2), Deneigus_PI_Arduino (U7.9)
ARD2_A1: Deneigus_Sensors (J28.3), Deneigus_PI_Arduino (U7.10)
ARD2_A2: Deneigus_Sensors (J34.2), Deneigus_PI_Arduino (U7.11)
ARD2_A3: Deneigus_Sensors (J34.3), Deneigus_PI_Arduino (U7.12)
ARD2_CS: Deneigus_Sensors (5 pins), Deneigus_PI_Arduino (U7.30)
ARD2_D26: Deneigus_PI_Arduino (U7.31), Deneigus_Servo (Q23.1)
ARD2_D28: Deneigus_PI_Arduino (U7.33), Deneigus_Servo (Q22.1)
ARD2_MISO: Deneigus_Sensors (5 pins), Deneigus_PI_Arduino (U7.28)
ARD2_MOSI: Deneigus_Sensors (5 pins), Deneigus_PI_Arduino (U7.27)
ARD2_SCK: Deneigus_Sensors (5 pins), Deneigus_PI_Arduino (U7.29)
ARD2_SCL: Deneigus_Sensors (J8.2), Deneigus_PI_Arduino (U7.86)
ARD2_SDA: Deneigus_Sensors (J8.3), Deneigus_PI_Arduino (U7.85)
BMS_RX: Deneigus_PI_Arduino (U10.63), Deneigus_BMS (U9.1)
BMS_RX_ENABLE: Deneigus_PI_Arduino (U10.31), Deneigus_BMS (U9.2)
BMS_TX: Deneigus_PI_Arduino (U10.64), Deneigus_BMS (U9.4)
BMS_TX_ENABLE: Deneigus_PI_Arduino (U10.33), Deneigus_BMS (U9.3)
Contrôle_EV200: Deneigus_POWER (Q11.1), Deneigus_PI_Arduino (U10.28)
CURRENT_SENSOR_MOTOR_OCD: Deneigus_Sensors (Current_Motor.4 R63.1), Deneigus_PI_Arduino (U10.30)
CURRENT_SENSOR_MOTOR_VOUT: Deneigus_Sensors (Current_Motor.3), Deneigus_PI_Arduino (U10.13)
CURRENT_SENSOR_MOTOR_VREF: Deneigus_Sensors (Current_Motor.2 R64.1 R65.1), Deneigus_PI_Arduino (U10.12)
CURRENT_SENSOR_TOTAL_OCD: Deneigus_Sensors (Current_Battery.4 R60.1), Deneigus_PI_Arduino (U10.32)
CURRENT_SENSOR_TOTAL_VOUT: Deneigus_Sensors (Current_Battery.3), Deneigus_PI_Arduino (U10.10)
CURRENT_SENSOR_TOTAL_VREF: Deneigus_Sensors (Current_Battery.2 R61.1 R62.1), Deneigus_PI_Arduino (U10.9)
E-Stop: Deneigus_POWER (R74.2 R75.1), Deneigus_PI_Arduino (U7.77 U10.77 U12.77)
Light 1: Deneigus_POWER (Q24.1), Deneigus_PI_Arduino (U7.43)
Light 2: Deneigus_POWER (Q25.1), Deneigus_PI_Arduino (U7.45)
Light 3: Deneigus_POWER (Q26.1), Deneigus_PI_Arduino (U7.47)
Light 4: Deneigus_POWER (Q27.1), Deneigus_PI_Arduino (U7.41)
PWM_Déplacement1: Deneigus_Controle_Deplacement (R16.1 R26.1), Deneigus_PI_Arduino (U7.74)
PWM_Déplacement2: Deneigus_Controle_Deplacement (R59.1 R66.1), Deneigus_PI_Arduino (U7.75)
PWM_Soufflante: Deneigus_Controle_Soufflante (R4.1), Deneigus_PI_Arduino (U7.81)
Sens_Rotation1: Deneigus_Controle_Deplacement (R25.1 U4.14), Deneigus_PI_Arduino (U7.78)
Sens_Rotation2: Deneigus_Controle_Deplacement (R37.1 U4.7), Deneigus_PI_Arduino (U7.79)
Soufflante_MAXSPEED: Deneigus_Controle_Soufflante (R8.1), Deneigus_PI_Arduino (U7.82)
Soufflante_OFF: Deneigus_Controle_Soufflante (R1.1), Deneigus_PI_Arduino (U7.80)
Switch1: Deneigus_Sensors (J9.2 R80.1 R81.2), Deneigus_PI_Arduino (U10.35)
Switch2: Deneigus_Sensors (J11.2 R82.1 R83.2), Deneigus_PI_Arduino (U10.37)
TEMPERATURE_BATTERY: Deneigus_PI_Arduino (U10.44), Deneigus_BMS (R73.1 Temp_Battery.2)
TEMPERATURE_MOTEUR: Deneigus_PI_Arduino (U10.42), Deneigus_BMS (R72.1 Temp_Motor.2)